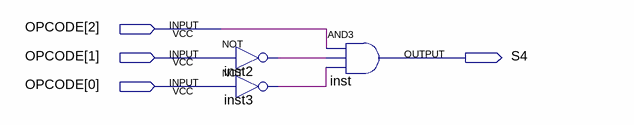
[diagram p0: schematic sheet]
// Quartus schematic DecoNOT.bdf as structural Verilog: 3 symbols, 4 pins
module DecoNOT (
  input  [2:0] OPCODE,
  output S4
);

  wire inst2_out, inst3_out;

  not inst2 (inst2_out, OPCODE[1]);
  not inst3 (inst3_out, OPCODE[0]);
  and inst (S4, OPCODE[2], inst2_out, inst3_out);
endmodule
